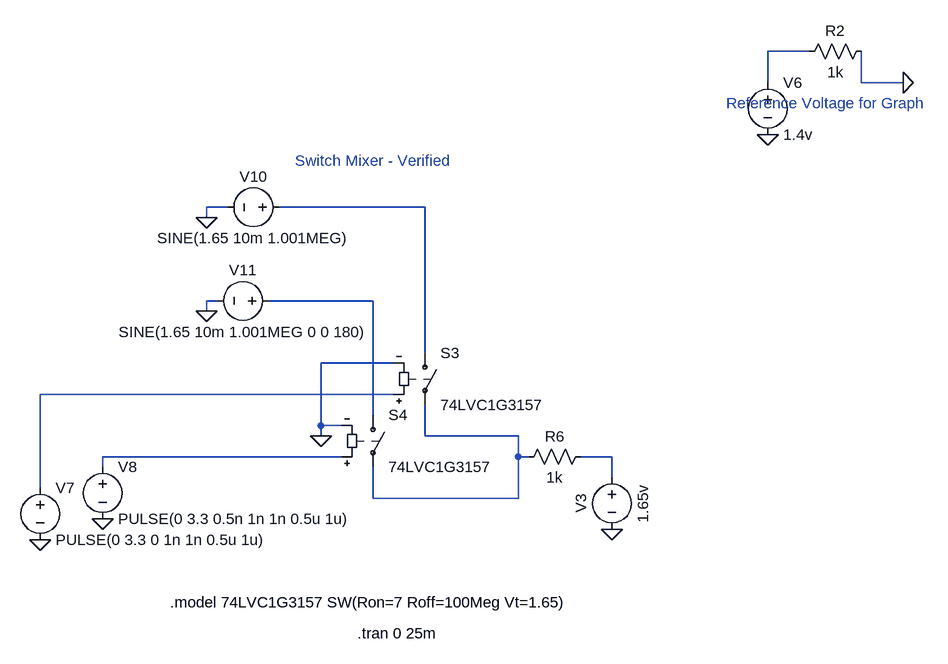
[diagram p0: schematic SDR-SwitchMixerSim.asc]
SDR-SwitchMixerSim.asc, the LTspice schematic file:
Version 4.1
SHEET 1 1428 1048
WIRE 912 48 848 48
WIRE 848 96 848 48
WIRE 992 96 992 48
WIRE 1056 96 992 96
WIRE 16 288 -16 288
WIRE 320 288 96 288
WIRE -16 304 -16 288
WIRE 0 432 -16 432
WIRE 240 432 80 432
WIRE -16 448 -16 432
WIRE 320 512 320 288
WIRE 272 528 160 528
WIRE 272 576 -272 576
WIRE 240 608 240 432
WIRE 160 624 160 528
WIRE 192 624 160 624
WIRE 160 640 160 624
WIRE 320 640 320 592
WIRE 464 640 320 640
WIRE 192 672 -176 672
WIRE 464 672 464 640
WIRE 480 672 464 672
WIRE 608 672 560 672
WIRE -176 688 -176 672
WIRE 608 704 608 672
WIRE -272 720 -272 576
WIRE 240 736 240 688
WIRE 464 736 464 672
WIRE 464 736 240 736
FLAG 848 176 0
FLAG 1056 96 0
FLAG 160 640 0
FLAG -272 800 0
FLAG -176 768 0
FLAG -16 448 0
FLAG -16 304 0
FLAG 608 784 0
SYMBOL voltage 848 80 R0
WINDOW 123 0 0 Left 0
WINDOW 39 0 0 Left 0
SYMATTR InstName V6
SYMATTR Value 1.4v
SYMBOL res 1008 32 R90
WINDOW 0 0 56 VBottom 2
WINDOW 3 32 56 VTop 2
SYMATTR InstName R2
SYMATTR Value 1k
SYMBOL voltage -272 704 R0
WINDOW 123 0 0 Left 0
WINDOW 39 0 0 Left 0
SYMATTR InstName V7
SYMATTR Value PULSE(0 3.3 0 1n 1n 0.5u 1u)
SYMBOL voltage -176 672 R0
WINDOW 123 0 0 Left 0
WINDOW 39 0 0 Left 0
SYMATTR InstName V8
SYMATTR Value PULSE(0 3.3 0.5n 1n 1n 0.5u 1u)
SYMBOL sw 320 496 R0
SYMATTR InstName S3
SYMATTR Value 74LVC1G3157
SYMBOL sw 240 592 R0
SYMATTR InstName S4
SYMATTR Value 74LVC1G3157
SYMBOL voltage 112 288 R90
WINDOW 0 -32 56 VBottom 2
WINDOW 3 32 56 VTop 2
WINDOW 123 0 0 Left 0
WINDOW 39 0 0 Left 0
SYMATTR InstName V10
SYMATTR Value SINE(1.65 10m 1.001MEG)
SYMBOL voltage 96 432 R90
WINDOW 0 -32 56 VBottom 2
WINDOW 3 32 56 VTop 2
WINDOW 123 0 0 Left 0
WINDOW 39 0 0 Left 0
SYMATTR InstName V11
SYMATTR Value SINE(1.65 10m 1.001MEG 0 0 180)
SYMBOL res 576 656 R90
WINDOW 0 0 56 VBottom 2
WINDOW 3 32 56 VTop 2
SYMATTR InstName R6
SYMATTR Value 1k
SYMBOL voltage 608 688 R0
WINDOW 0 -32 56 VBottom 2
WINDOW 3 32 56 VTop 2
WINDOW 123 0 0 Left 0
WINDOW 39 0 0 Left 0
SYMATTR InstName V3
SYMATTR Value 1.65v
TEXT -72 896 Left 2 !.model 74LVC1G3157 SW(Ron=7 Roff=100Meg Vt=1.65)
TEXT 120 216 Left 2 ;Switch Mixer - Verified
TEXT 784 128 Left 2 ;Reference Voltage for Graph
TEXT 216 944 Left 2 !.tran 0 25m

The netlist it stands for:
* SDR-SwitchMixerSim.asc
V6 N001 0 1.4v
R2 0 N001 1k
V7 N004 0 PULSE(0 3.3 0 1n 1n 0.5u 1u)
V8 N006 0 PULSE(0 3.3 0.5n 1n 1n 0.5u 1u)
S3 N002 N005 N004 0 74LVC1G3157
S4 N003 N005 N006 0 74LVC1G3157
V10 N002 0 SINE(1.65 10m 1.001MEG)
V11 N003 0 SINE(1.65 10m 1.001MEG 0 0 180)
R6 N007 N005 1k
V3 N007 0 1.65v
.model 74LVC1G3157 SW(Ron=7 Roff=100Meg Vt=1.65)
* Switch Mixer - Verified
* Reference Voltage for Graph
.tran 0 25m
.backanno
.end